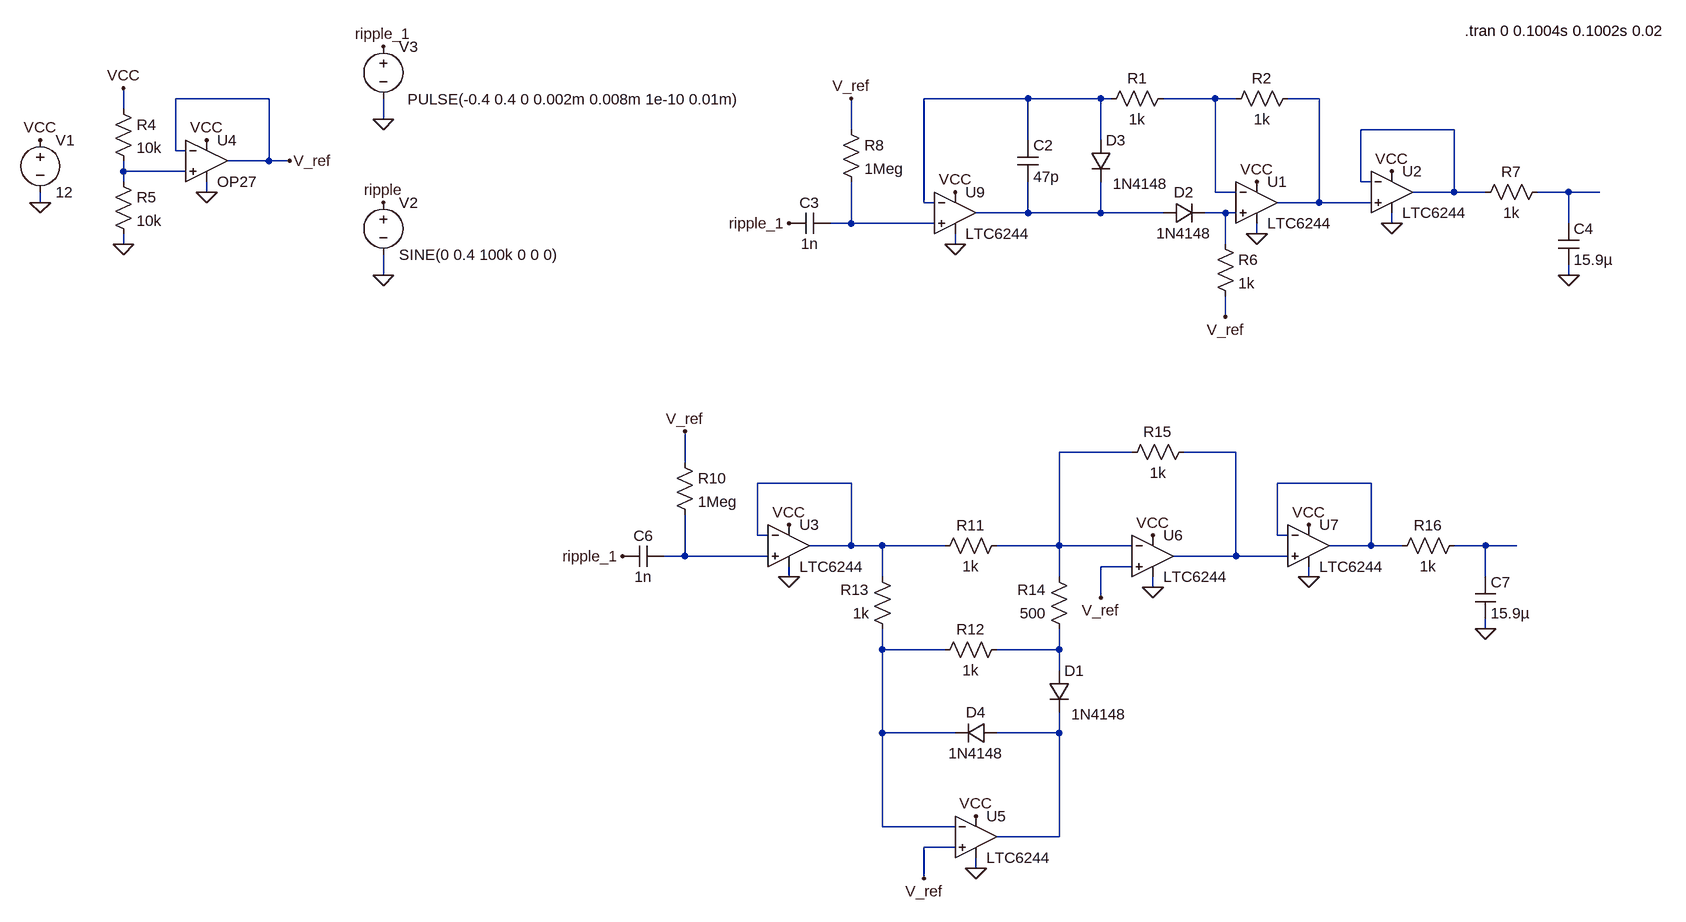
[diagram p0: schematic precision_rectifier.asc]
precision_rectifier.asc, the LTspice schematic file:
Version 4
SHEET 1 1220 1164
WIRE -1248 -144 -1392 -144
WIRE -80 -144 -240 -144
WIRE 32 -144 -80 -144
WIRE 48 -144 32 -144
WIRE 208 -144 128 -144
WIRE 240 -144 208 -144
WIRE 368 -144 320 -144
WIRE -1472 -128 -1472 -160
WIRE -1072 -112 -1072 -144
WIRE -352 -96 -352 -144
WIRE 576 -96 432 -96
WIRE -80 -80 -80 -144
WIRE 32 -80 32 -144
WIRE -1392 -64 -1392 -144
WIRE -1376 -64 -1392 -64
WIRE -1248 -48 -1248 -144
WIRE -1248 -48 -1312 -48
WIRE -1216 -48 -1248 -48
WIRE -1472 -32 -1472 -48
WIRE -1376 -32 -1472 -32
WIRE -1472 -16 -1472 -32
WIRE 432 -16 432 -96
WIRE 448 -16 432 -16
WIRE -1344 0 -1344 -16
WIRE 208 0 208 -144
WIRE 240 0 208 0
WIRE 576 0 576 -96
WIRE 576 0 512 0
WIRE 624 0 576 0
WIRE 752 0 704 0
WIRE 800 0 752 0
WIRE -1600 16 -1600 0
WIRE -240 16 -240 -144
WIRE -224 16 -240 16
WIRE 368 16 368 -144
WIRE 368 16 304 16
WIRE 448 16 368 16
WIRE -80 32 -80 -16
WIRE -80 32 -160 32
WIRE 32 32 32 -16
WIRE 32 32 -80 32
WIRE 128 32 32 32
WIRE 224 32 192 32
WIRE 240 32 224 32
WIRE -352 48 -352 -16
WIRE -352 48 -384 48
WIRE -224 48 -352 48
WIRE 480 48 480 32
WIRE 752 48 752 0
WIRE 272 64 272 48
WIRE -1472 80 -1472 64
WIRE -192 80 -192 64
WIRE 224 80 224 32
WIRE -1072 128 -1072 96
WIRE 752 128 752 112
WIRE 224 192 224 160
WIRE 80 400 -32 400
WIRE 240 400 160 400
WIRE -608 416 -608 368
WIRE -352 448 -496 448
WIRE 448 448 304 448
WIRE -496 528 -496 448
WIRE -480 528 -496 528
WIRE 304 528 304 448
WIRE 320 528 304 528
WIRE -352 544 -352 448
WIRE -352 544 -416 544
WIRE -304 544 -352 544
WIRE -208 544 -304 544
WIRE -32 544 -32 400
WIRE -32 544 -128 544
WIRE 80 544 -32 544
WIRE 448 544 448 448
WIRE 448 544 384 544
WIRE 496 544 448 544
WIRE 624 544 576 544
WIRE 672 544 624 544
WIRE -608 560 -608 496
WIRE -608 560 -640 560
WIRE -480 560 -608 560
WIRE 240 560 240 400
WIRE 240 560 144 560
WIRE 320 560 240 560
WIRE 80 576 32 576
WIRE -448 592 -448 576
WIRE -304 592 -304 544
WIRE -32 592 -32 544
WIRE 352 592 352 576
WIRE 624 592 624 544
WIRE 112 608 112 592
WIRE 32 624 32 576
WIRE 624 672 624 656
WIRE -304 704 -304 672
WIRE -208 704 -304 704
WIRE -32 704 -32 672
WIRE -32 704 -128 704
WIRE -32 736 -32 704
WIRE -304 832 -304 704
WIRE -192 832 -304 832
WIRE -32 832 -32 800
WIRE -32 832 -128 832
WIRE -304 976 -304 832
WIRE -192 976 -304 976
WIRE -32 992 -32 832
WIRE -32 992 -128 992
WIRE -192 1008 -240 1008
WIRE -160 1040 -160 1024
WIRE -240 1056 -240 1008
FLAG -1600 16 0
FLAG -1600 -80 VCC
FLAG -1072 128 0
FLAG -1072 16 ripple
FLAG -1472 -160 VCC
FLAG -1472 80 0
FLAG -1216 -48 V_ref
FLAG -192 0 VCC
FLAG 272 -16 VCC
FLAG -192 80 0
FLAG 272 64 0
FLAG 224 192 V_ref
FLAG -1344 -80 VCC
FLAG -1344 0 0
FLAG 480 -32 VCC
FLAG 480 48 0
FLAG 752 128 0
FLAG -1072 -112 0
FLAG -1072 -224 ripple_1
FLAG -352 -144 V_ref
FLAG -608 368 V_ref
FLAG -704 560 ripple_1
FLAG -160 960 VCC
FLAG -160 1040 0
FLAG 112 528 VCC
FLAG 112 608 0
FLAG 352 512 VCC
FLAG 352 592 0
FLAG 624 672 0
FLAG -448 512 VCC
FLAG -448 592 0
FLAG -240 1056 V_ref
FLAG 32 624 V_ref
FLAG -448 48 ripple_1
SYMBOL voltage -1600 -96 R0
WINDOW 123 0 0 Left 0
WINDOW 39 0 0 Left 0
SYMATTR InstName V1
SYMATTR Value 12
SYMBOL voltage -1072 0 R0
WINDOW 123 0 0 Left 0
WINDOW 39 0 0 Left 0
SYMATTR InstName V2
SYMATTR Value SINE(0 0.4 100k 0 0 0)
SYMBOL res -1488 -144 R0
SYMATTR InstName R4
SYMATTR Value 10k
SYMBOL res -1488 -32 R0
SYMATTR InstName R5
SYMATTR Value 10k
SYMBOL diode 128 48 R270
WINDOW 0 32 32 VTop 2
WINDOW 3 0 32 VBottom 2
SYMATTR InstName D2
SYMATTR Value 1N4148
SYMBOL diode 16 -80 R0
WINDOW 3 35 67 Left 2
SYMATTR Value 1N4148
SYMATTR InstName D3
SYMBOL res 144 -160 R90
WINDOW 0 0 56 VBottom 2
WINDOW 3 32 56 VTop 2
SYMATTR InstName R1
SYMATTR Value 1k
SYMBOL res 336 -160 R90
WINDOW 0 0 56 VBottom 2
WINDOW 3 32 56 VTop 2
SYMATTR InstName R2
SYMATTR Value 1k
SYMBOL cap -96 -80 R0
SYMATTR InstName C2
SYMATTR Value 47p
SYMBOL res 208 64 R0
SYMATTR InstName R6
SYMATTR Value 1k
SYMBOL Opamps\\OP27 -1344 -112 R0
SYMATTR InstName U4
SYMBOL res 720 -16 R90
WINDOW 0 0 56 VBottom 2
WINDOW 3 32 56 VTop 2
SYMATTR InstName R7
SYMATTR Value 1k
SYMBOL cap 736 48 R0
SYMATTR InstName C4
SYMATTR Value 15.9µ
SYMBOL voltage -1072 -240 R0
WINDOW 3 37 97 Left 2
WINDOW 123 0 0 Left 0
WINDOW 39 0 0 Left 0
SYMATTR Value PULSE(-0.4 0.4 0 0.002m 0.008m 1e-10 0.01m)
SYMATTR InstName V3
SYMBOL cap -384 32 R90
WINDOW 0 0 32 VBottom 2
WINDOW 3 32 32 VTop 2
SYMATTR InstName C3
SYMATTR Value 1n
SYMBOL res -368 -112 R0
SYMATTR InstName R8
SYMATTR Value 1Meg
SYMBOL cap -640 544 R90
WINDOW 0 0 32 VBottom 2
WINDOW 3 32 32 VTop 2
SYMATTR InstName C6
SYMATTR Value 1n
SYMBOL res -624 400 R0
SYMATTR InstName R10
SYMATTR Value 1Meg
SYMBOL res -112 528 R90
WINDOW 0 0 56 VBottom 2
WINDOW 3 32 56 VTop 2
SYMATTR InstName R11
SYMATTR Value 1k
SYMBOL res -112 688 R90
WINDOW 0 0 56 VBottom 2
WINDOW 3 32 56 VTop 2
SYMATTR InstName R12
SYMATTR Value 1k
SYMBOL res -288 688 R180
WINDOW 0 36 76 Left 2
WINDOW 3 36 40 Left 2
SYMATTR InstName R13
SYMATTR Value 1k
SYMBOL res -16 688 R180
WINDOW 0 36 76 Left 2
WINDOW 3 36 40 Left 2
SYMATTR InstName R14
SYMATTR Value 500
SYMBOL diode -48 736 R0
WINDOW 3 35 67 Left 2
SYMATTR Value 1N4148
SYMATTR InstName D1
SYMBOL diode -128 816 R90
WINDOW 3 32 32 VTop 2
WINDOW 0 0 32 VBottom 2
SYMATTR Value 1N4148
SYMATTR InstName D4
SYMBOL res 176 384 R90
WINDOW 0 0 56 VBottom 2
WINDOW 3 32 56 VTop 2
SYMATTR InstName R15
SYMATTR Value 1k
SYMBOL res 592 528 R90
WINDOW 0 0 56 VBottom 2
WINDOW 3 32 56 VTop 2
SYMATTR InstName R16
SYMATTR Value 1k
SYMBOL cap 608 592 R0
SYMATTR InstName C7
SYMATTR Value 15.9µ
SYMBOL OpAmps\\LTC6244 -192 32 R0
SYMATTR InstName U9
SYMBOL OpAmps\\LTC6244 272 16 R0
SYMATTR InstName U1
SYMBOL OpAmps\\LTC6244 480 0 R0
SYMATTR InstName U2
SYMBOL OpAmps\\LTC6244 -448 544 R0
SYMATTR InstName U3
SYMBOL OpAmps\\LTC6244 112 560 R0
SYMATTR InstName U6
SYMBOL OpAmps\\LTC6244 352 544 R0
SYMATTR InstName U7
SYMBOL OpAmps\\LTC6244 -160 992 R0
SYMATTR InstName U5
TEXT 592 -248 Left 2 !.tran 0 0.1004s 0.1002s 0.02

The netlist it stands for:
* precision_rectifier.asc
V1 VCC 0 12
V2 ripple 0 SINE(0 0.4 100k 0 0 0)
R4 VCC N005 10k
R5 N005 0 10k
D2 N007 N008 1N4148
D3 N001 N007 1N4148
R1 N002 N001 1k
R2 N003 N002 1k
C2 N001 N007 47p
R6 N008 V_ref 1k
XU4 N005 V_ref VCC 0 V_ref OP27  ; pins In+ In- V+ V- OUT
R7 N006 N004 1k
C4 N006 0 15.9µ
V3 ripple_1 0 PULSE(-0.4 0.4 0 0.002m 0.008m 1e-10 0.01m)
C3 N009 ripple_1 1n
R8 V_ref N009 1Meg
C6 N015 ripple_1 1n
R10 V_ref N015 1Meg
R11 N010 N012 1k
R12 N017 N016 1k
R13 N016 N012 1k
R14 N017 N010 500
D1 N017 N018 1N4148
D4 N018 N016 1N4148
R15 N011 N010 1k
R16 N014 N013 1k
C7 N014 0 15.9µ
XU9 N009 N001 VCC 0 N007 LTC6244  ; pins In+ In- V+ V- OUT
XU1 N008 N002 VCC 0 N003 LTC6244  ; pins In+ In- V+ V- OUT
XU2 N003 N004 VCC 0 N004 LTC6244  ; pins In+ In- V+ V- OUT
XU3 N015 N012 VCC 0 N012 LTC6244  ; pins In+ In- V+ V- OUT
XU6 V_ref N010 VCC 0 N011 LTC6244  ; pins In+ In- V+ V- OUT
XU7 N011 N013 VCC 0 N013 LTC6244  ; pins In+ In- V+ V- OUT
XU5 V_ref N016 VCC 0 N018 LTC6244  ; pins In+ In- V+ V- OUT
.model D D
.lib standard.dio
.tran 0 0.1004s 0.1002s 0.02
.lib ADI.lib
.backanno
.end